# EasyEDA Pro project moss-datalight-pcb.eprj

# Schematic Schematic1
Create Date: 2023-03-12; Page Name: P1; Project Name: moss-datalight-pcb; Schematic Name: Schematic1; Update Date: 2023-04-20; Company: 嘉立创EDA; Page Size: A4; Version: V1.0
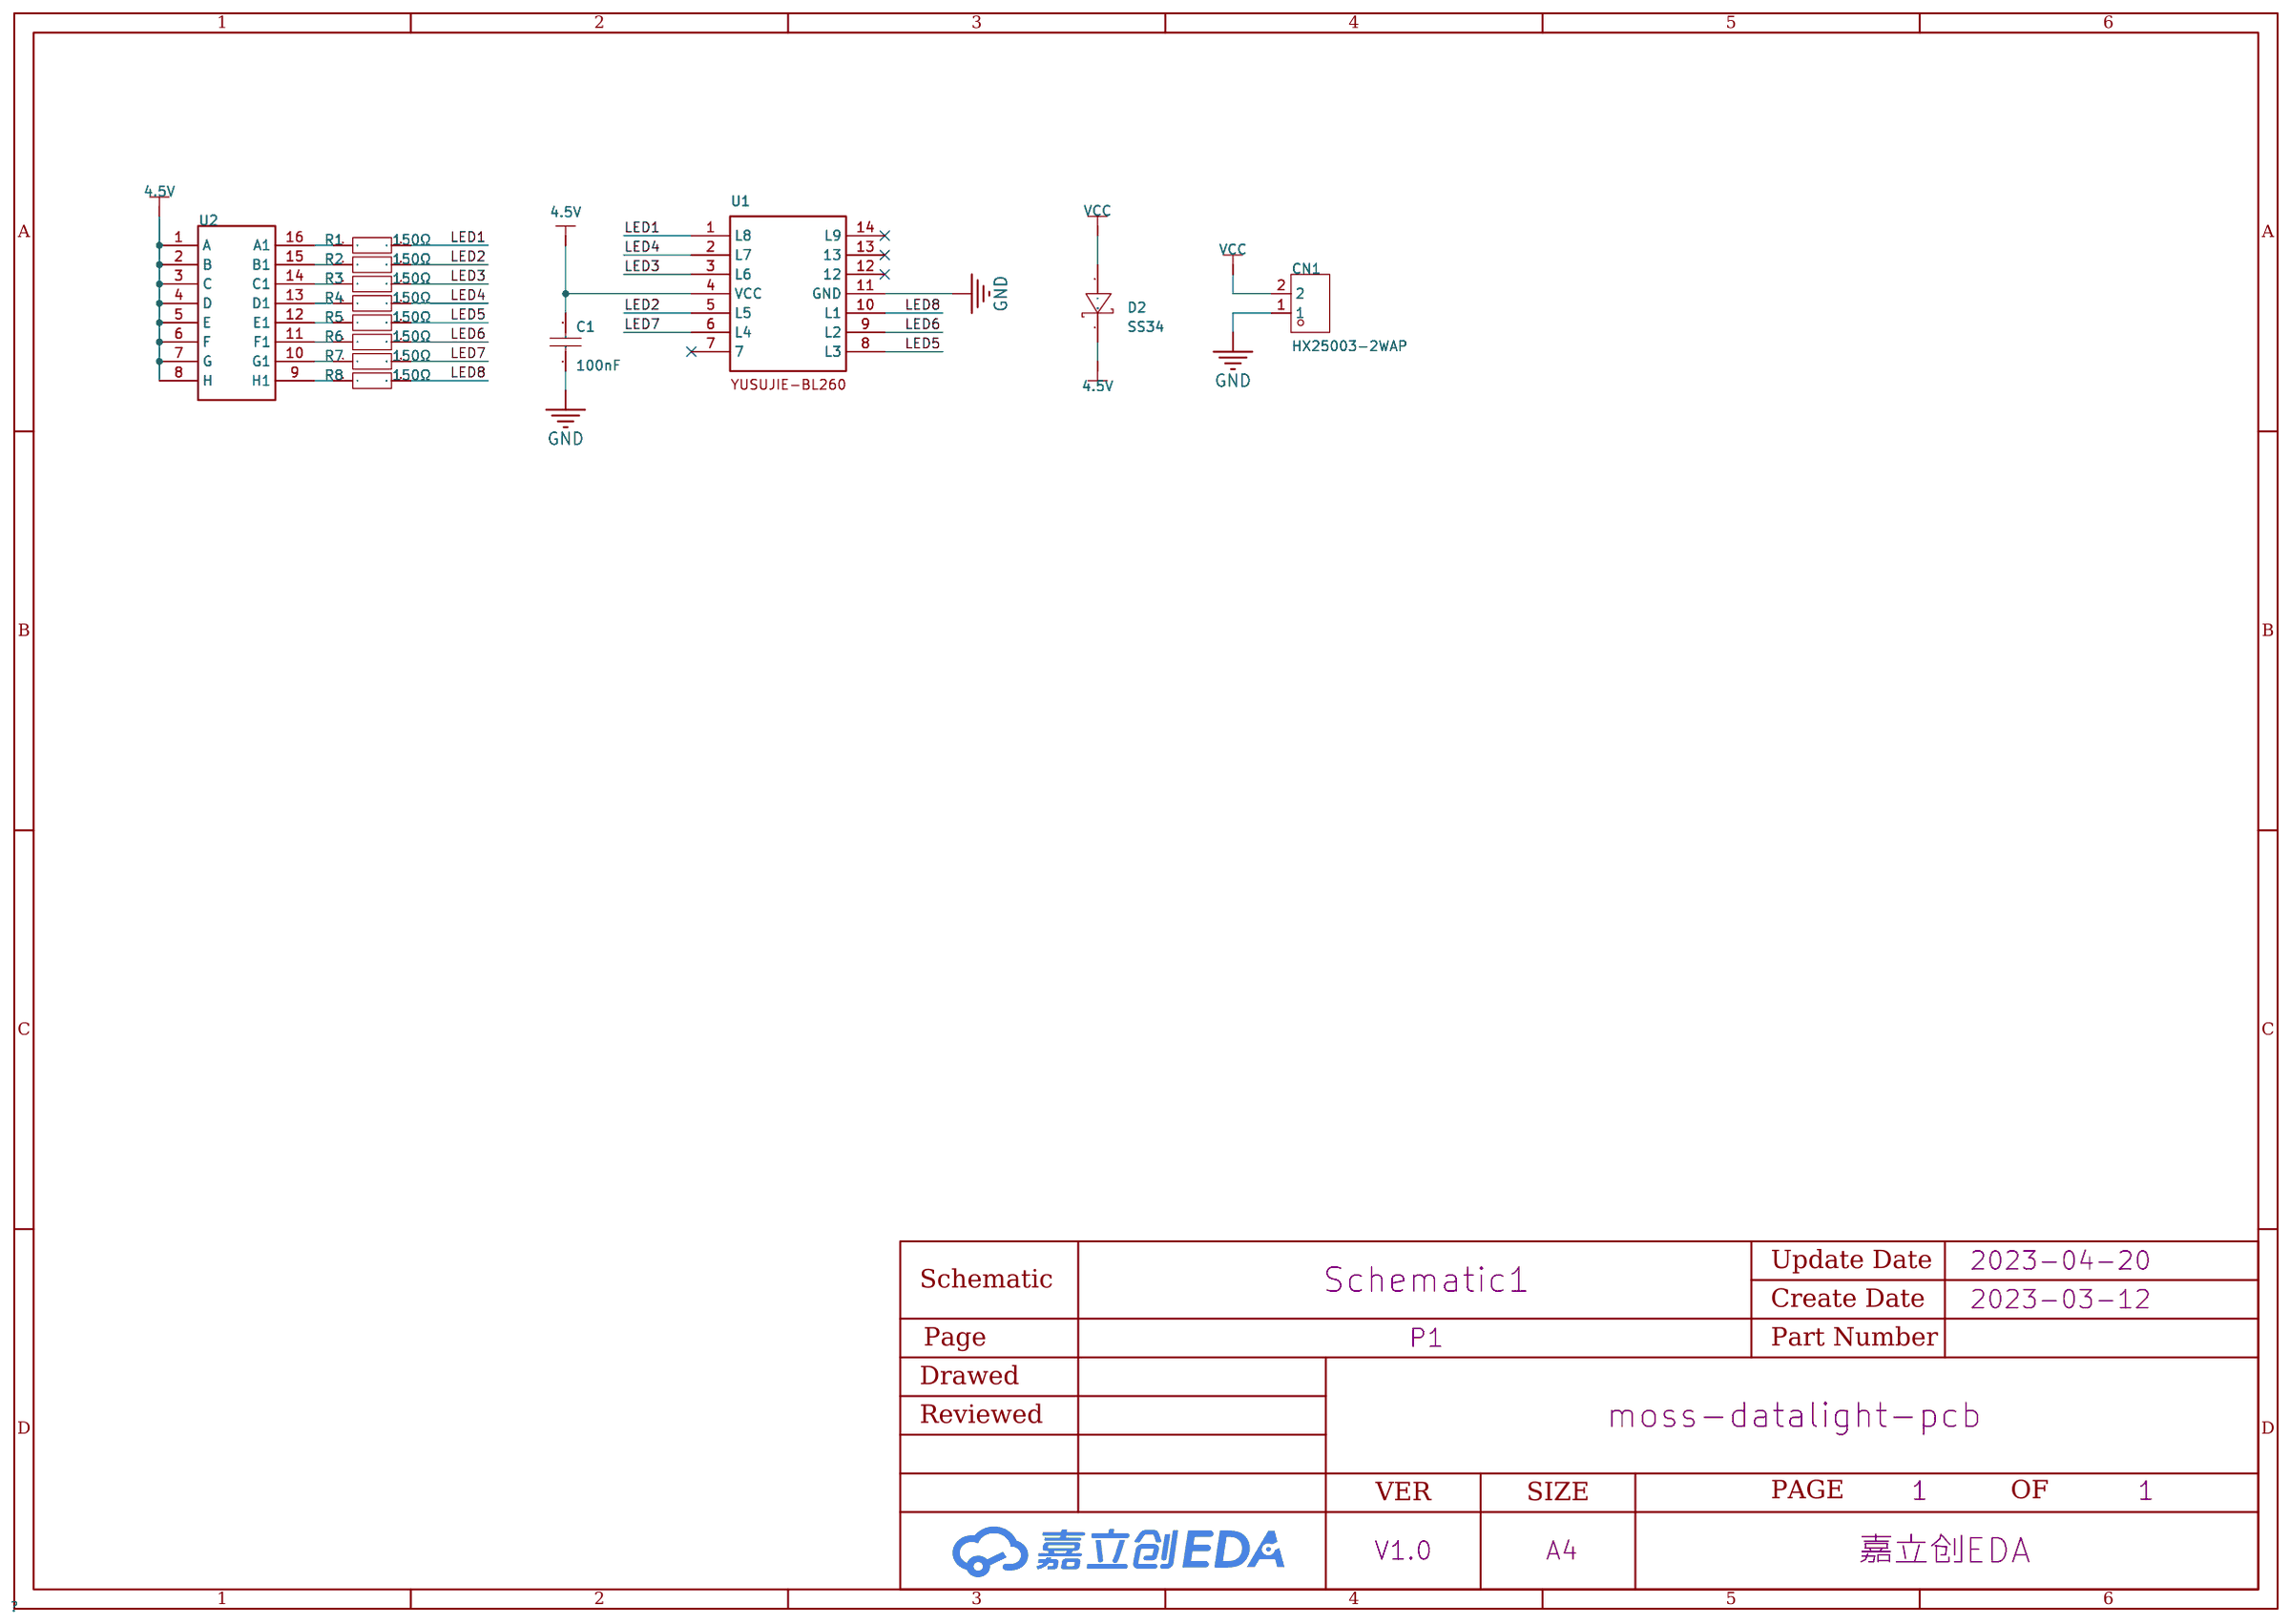
[diagram p0: schematic sheet]

## Parts
C1  100nF  [C0402_NEW]
CN1  HX25003-2WAP  [CONN-TH_2P-P2.50_HX25003-2WAP]
D2  SS34  [SMA_L4.4-W2.6-LS5.0-RD]
R1  150Ω  [R0603]
R2  150Ω  [R0603]
R3  150Ω  [R0603]
R4  150Ω  [R0603]
R5  150Ω  [R0603]
R6  150Ω  [R0603]
R7  150Ω  [R0603]
R8  150Ω  [R0603]
U1  -  [YUSUJIE-BL260]
U2  -  [B8R]

## Library data of the parts
C1 = CL05B104KO5NNNC: 容值:100nF;精度:±10%;额定电压:16V;材质(温度系数):X7R;; LCSC Part Name: 100nF ±10% 16V; Supplier Part: C1525; Manufacturer: SAMSUNG(三星); Supplier Footprint: 0402; JLCPCB Part Class: Basic Part; Datasheet: https://atta.szlcsc.com/upload/public/pdf/source/20160103/1457707674891.pdf; Supplier: LCSC; Tolerance: ±10%; Voltage Rated: 16V; Temperature Coefficient: X7R
CN1 = HX25003-2WAP: 参考系列:XH;间距:2.5mm;插针结构:1x2P;排数:1;每排PIN数:2;行距:-;公母:公型插针;安装方式:弯插;额定电流:-;工作温度范围:-;; LCSC Part Name: XH 2.5mm 1x2P 弯插 母座; Supplier Part: C442326; Manufacturer: HX(红星); Supplier Footprint: 插件,P=2.5mm; JLCPCB Part Class: Extended Part; Datasheet: https://atta.szlcsc.com/upload/public/pdf/source/20191028/C442326_951D1FF48F4BC139C99E649B2A876D28.pdf; Supplier: LCSC; Reference Series: XH; Pitch: 2.5mm; Pins Structure: 1x2P; Number of Rows: 1; Number of PINs Per Row: 2; Gender: 公型插针; Mounting Style: 弯插
D2 = SS34_C408258: 直流反向耐压(Vr):40V;平均整流电流(Io):3A;正向压降(Vf):500mV@3A;; LCSC Part Name: 40V 3A 500mV@3A; Supplier Part: C408258; Manufacturer: Slkor(萨科微); Supplier Footprint: SMA; JLCPCB Part Class: Extended Part; Datasheet: https://atta.szlcsc.com/upload/public/pdf/source/20190729/C408258_B89804B8B5843AB8B6DB9D5CEE0FD81B.pdf; Supplier: LCSC; Reverse Voltage (Vr): 40V; Average Rectified Current (Io): 3A; Forward Voltage (Vf@If): 500mV@3A
R1-R8 = 0603WAF1500T5E: 电阻类型:厚膜电阻;阻值:150Ω;精度:±1%;功率:100mW;; LCSC Part Name: 150Ω ±1% 100mW; Supplier Part: C22808; Manufacturer: UNI-ROYAL(厚声); Supplier Footprint: 0603; JLCPCB Part Class: Basic Part; Datasheet: https://atta.szlcsc.com/upload/public/pdf/source/20200306/C422600_1E6D84923E4A46A82E41ADD87F860B5C.pdf; Supplier: LCSC; Type: 厚膜电阻; Tolerance: ±1%; Power(Watts): 100mW; Temperature Coefficient: ±100ppm/℃; Overload Voltage (Max): 75V; Operating Temperature Range: -55℃~+155℃
U1 = YUSUJIE-BL260: 宇思捷8路火苗模拟IC
U2 = B8R

## Nets
4.5V: C1.2 D2.1(C) U1.4(VCC) U2.1(A) U2.2(B) U2.3(C) U2.4(D) U2.5(E) U2.6(F) U2.7(G) U2.8(H)
GND: C1.1 CN1.1 U1.11(GND)
VCC: CN1.2 D2.2(A)
LED1: R1.2 U1.1(L8)
LED2: R2.2 U1.5(L5)
LED3: R3.2 U1.3(L6)
LED4: R4.2 U1.2(L7)
LED5: R5.2 U1.8(L3)
LED6: R6.2 U1.9(L2)
LED7: R7.2 U1.6(L4)
LED8: R8.2 U1.10(L1)
$1N2967: R1.1 U2.16(A1)
$1N3042: R2.1 U2.15(B1)
$1N3167: R3.1 U2.14(C1)
$1N3268: R4.1 U2.13(D1)
$1N3278: R5.1 U2.12(E1)
$1N3288: R6.1 U2.11(F1)
$1N3298: R7.1 U2.10(G1)
$1N3308: R8.1 U2.9(H1)

Not connected (* = marked no-connect by the designer): U1 7* 12* 13* 14(L9)*

# Board PCB1
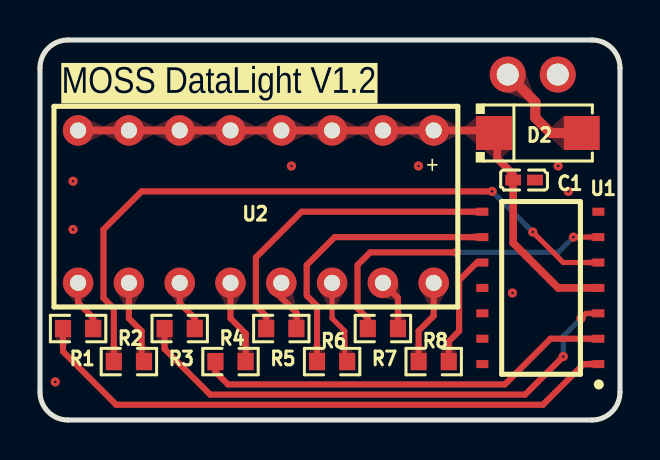
[diagram p1: board, top side]
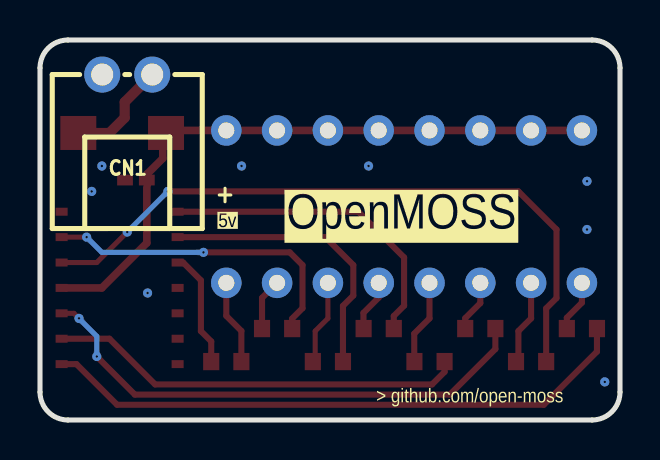
[diagram p2: board, bottom side, seen from below]

Outline 29 x 19 mm; copper layers: Top Layer, Bottom Layer. Coordinates in mm from the lower left corner of the outline.
Outline path: 0,17.6 0,1.4 arc(0.41,0.41) 1.4,0 27.6,0 arc(28.59,0.41) 29,1.4 29,17.6 arc(28.59,18.59) 27.6,19 1.4,19 arc(0.41,18.59) 0,17.6
Stack: Top Layer 0.035mm / Dielectric1 1.51mm FR4 er 4.5 / Bottom Layer 0.035mm

## Design rules (mm)
spacing safeClearance (default): track to track 0.152, other pairs 0.152 to 0.3
track width trackWidth (default): min 0.127, default 0.254, max 2.54
differential pair differentialPair (default): width min 0.127, default 0.254, max 2.54; gap min 0.152, default 0.152
via viaSize (default): diameter min 0.1, default 0.61, max 10; hole min 0.1, default 0.305, max 6

## Placement (name value [footprint] x y rotation side)
C1  100nF  [C0402_NEW]  24.2 12 180 top
CN1  HX25003-2WAP  [CONN-TH_2P-P2.50_HX25003-2WAP]  24.64 17.27 180 bottom
D2  SS34  [SMA_L4.4-W2.6-LS5.0-RD]  24.89 14.35 0 top
R1  150Ω  [R0603]  1.91 4.57 180 top
R2  150Ω  [R0603]  4.44 2.92 180 top
R3  150Ω  [R0603]  6.98 4.57 180 top
R4  150Ω  [R0603]  9.52 2.92 180 top
R5  150Ω  [R0603]  12.06 4.57 180 top
R6  150Ω  [R0603]  14.6 2.92 180 top
R7  150Ω  [R0603]  17.14 4.57 180 top
R8  150Ω  [R0603]  19.69 2.92 0 top
U1  -  [YUSUJIE-BL260]  25.02 6.6 270 top
U2  -  [B8R]  10.79 10.67 0 top

## Footprints (pads in the part's own frame, mm; a bottom-side part is the same pattern mirrored in y, then rotated)
B8R
  round 1.524 hole 0.8: 1(8.89,3.81) 2(6.35,3.81) 3(3.81,3.81) 4(1.27,3.81) 5(-1.27,3.81) 6(-3.81,3.81) 7(-6.35,3.81) 8(-8.89,3.81) 9(8.89,-3.81) 10(6.35,-3.81) 11(3.81,-3.81) 12(1.27,-3.81) 13(-1.27,-3.81) 14(-3.81,-3.81) 15(-6.35,-3.81) 16(-8.89,-3.81)
C0402_NEW
  rect 0.79x0.54 smd: 1(-0.545,0) 2(0.545,0)
CONN-TH_2P-P2.50_HX25003-2WAP
  round 1.8 hole 1.1: 1(-1.25,0) 2(1.25,0)
R0603
  rect 0.806x0.864 smd: 1(-0.753,0) 2(0.753,0)
SMA_L4.4-W2.6-LS5.0-RD
  rect 1.8x1.7 smd: 1(-2.192,0) 2(2.192,0)
YUSUJIE-BL260
  rect 0.4x0.6 smd: 1(3.81,2.9) 2(2.54,2.9) 3(1.27,2.9) 4(0,2.9) 5(-1.27,2.9) 6(-2.54,2.9) 7(-3.81,2.9) 8(-3.81,-2.9) 9(-2.54,-2.9) 10(-1.27,-2.9) 11(0,-2.9) 12(1.27,-2.9) 13(2.54,-2.9) 14(3.81,-2.9)

## Nets
As in the schematic.

Pads without a net: U1 7 12 13 14

## Via types
v1: diameter 0.457, hole 0.127, Top Layer to Bottom Layer, 14 vias

## Routing (per net, layer and track width the routed paths; a pad name or vN(x,y) marks a point on that pad's centre or on a via; arc(x,y) is an arc through that point)
4.5V: length 31.6
  Top Layer w0.381: 23.66,11.62 23.66,8.85 25.91,6.6 27.66,6.6 ; 22.7,13.84 22.06,14.48 U2.1 U2.2 U2.3 U2.4 U2.5 U2.6 U2.7 1.91,14.48 ; 23.33,14 23.3,14.03 22.86,13.59 22.86,13.08 23.63,12.31 23.63,11.77
GND:
  vias: v1(0.76,1.91) v1(1.65,11.94) v1(1.65,9.53) v1(12.57,12.7) v1(18.92,12.7) v1(23.62,6.35) v1(25.91,12.7) v1(26.42,11.43)
VCC: length 5.4
  Top Layer w0.508: D2.2 25.53,14.35 24.76,15.11 24.76,15.89 CN1.2
LED1: length 29.9
  Top Layer w0.305: U1.1 27.18,2.79 25.15,0.76 3.81,0.76 1.15,3.42 R1.2
LED2: length 33.8
  Top Layer w0.254: v1(24.64,9.4) 26.16,7.87 U1.5
  Top Layer w0.305: v1(22.61,11.43) 5.08,11.43 3.17,9.53 3.17,6.1 3.69,5.58 R2.2
  Bottom Layer w0.254: v1(22.61,11.43) v1(24.64,9.4)
LED3: length 25.9
  Top Layer w0.254: v1(27.05,5.08) 27.3,5.33 U1.3
  Top Layer w0.305: R3.2 6.23,3.55 8.51,1.27 24.26,1.27 v1(26.16,3.17)
  Bottom Layer w0.254: v1(27.05,5.08) 26.16,4.19 v1(26.16,3.17)
LED4: length 20.9
  Top Layer w0.305: R4.2 8.77,2.4 9.4,1.78 23.24,1.78 25.53,4.06 U1.2
LED5: length 16
  Top Layer w0.305: R5.2 11.31,5.2 10.79,5.72 10.79,8.13 13.08,10.41 U1.8
LED6: length 14.4
  Top Layer w0.305: U1.9 14.73,9.14 13.33,7.75 13.33,6.22 13.85,5.71 R6.2
LED7: length 16
  Top Layer w0.254: v1(26.67,9.14) U1.6
  Top Layer w0.305: v1(20.83,8.38) 16.51,8.38 15.88,7.75 15.88,5.59 16.39,5.07 R7.2
  Bottom Layer w0.254: v1(20.83,8.38) 25.91,8.38 v1(26.67,9.14)
LED8: length 5.9
  Top Layer w0.305: 22.22,7.87 21.84,7.87 20.95,6.98 20.95,4.45 20.44,3.93 R8.2
$1N2967: length 2.6
  Top Layer w0.305: R1.1 2.66,5.11 1.91,5.86 1.91,6.86
$1N3042: length 4
  Top Layer w0.305: 5.08,3.17 5.08,4.45 4.44,5.08 U2.15
$1N3167: length 2.6
  Top Layer w0.305: U2.14 6.98,5.84 7.74,5.09 R3.1
$1N3268: length 4.3
  Top Layer w0.305: 10.41,2.92 10.29,3.04 10.29,4.32 9.52,5.08 U2.13
$1N3278: length 2.4
  Top Layer w0.305: U2.12 12.06,6.12 12.83,5.36 12.83,4.82
$1N3288: length 4.3
  Top Layer w0.254: 15.49,2.92 15.24,3.17 15.24,4.45 14.6,5.08 U2.11
$1N3298: length 2.6
  Top Layer w0.305: R7.1 17.9,6.1 U2.10
$1N3308: length 4.2
  Top Layer w0.305: R8.1 18.93,4.45 19.69,5.21 U2.9

## Copper pours and planes (outline as drawn; the poured copper is in the pictures)
GND on Top Layer: 0,17.6 0.01,17.75 0.05,17.98 0.14,18.21 0.26,18.41 0.41,18.59 0.59,18.74 0.79,18.86 1.02,18.95 1.25,18.99 1.4,19 27.6,19 27.75,18.99 27.98,18.95 28.21,18.86 28.41,18.74 28.59,18.59 28.74,18.41 28.86,18.21 28.95,17.98 28.99,17.75 29,17.6 29,1.4 28.99,1.25 28.95,1.02 28.86,0.79 28.74,0.59 28.59,0.41 28.41,0.26 28.21,0.14 27.98,0.05 27.75,0.01 27.6,0 1.4,0 1.25,0.01 1.02,0.05 0.79,0.14 0.59,0.26 0.41,0.41 0.26,0.59 0.14,0.79 0.05,1.02 0.01,1.25 0,1.4
GND on Bottom Layer: 0,17.6 0.01,17.75 0.05,17.98 0.14,18.21 0.26,18.41 0.41,18.59 0.59,18.74 0.79,18.86 1.02,18.95 1.25,18.99 1.4,19 27.6,19 27.75,18.99 27.98,18.95 28.21,18.86 28.41,18.74 28.59,18.59 28.74,18.41 28.86,18.21 28.95,17.98 28.99,17.75 29,17.6 29,1.4 28.99,1.25 28.95,1.02 28.86,0.79 28.74,0.59 28.59,0.41 28.41,0.26 28.21,0.14 27.98,0.05 27.75,0.01 27.6,0 1.4,0 1.25,0.01 1.02,0.05 0.79,0.14 0.59,0.26 0.41,0.41 0.26,0.59 0.14,0.79 0.05,1.02 0.01,1.25 0,1.4

Small or netless copper shapes (teardrops, artwork), in the pictures only: 58 on Top Layer, 6 on Bottom Layer

## Text on the board
Bottom Silkscreen Layer: + | > github.com/open-moss | 5v | OpenMOSS
Top Silkscreen Layer: + | MOSS DataLight V1.2
